# Altium schematic sheet DCTODC_Multioutput.SchDoc
size A4; Date: Not shown in title block; ApprovedBy: Not shown in title block; CheckedBy: Not shown in title block; Author: Not shown in title block; CompanyName: Not shown in title block; Engineer: Not shown in title block; Organization: Not shown in title block; Address1: Not shown in title block; Address2: Not shown in title block; Address3: Not shown in title block; Address4: Not shown in title block; DocumentNumber: 1; Revision: Use project parameter SCH_Rev; SheetNumber: 1; SheetTotal: 1; PageSetup: Record=PageOptions|CenterHorizontal=True|CenterVertical=True|PrintScale=1.00|XCorrection=1.00|YCorrection=1.00|PrintKind=0|BorderSize=5000000|LeftOffset=0|BottomOffset=0|Orientation=2|PaperLength=1000|PaperWidth=1000|Scale=100|PaperSource=15|PrintQuality=600|MediaType=1|DitherType=10|PaperKind=Letter|PrintScaleMode=1; CurrentTime: Not shown in title block; CurrentDate: Not shown in title block; Time: Not shown in title block; DocumentFullPathAndName: Not shown in title block; DocumentName: Not shown in title block; ModifiedDate: Not shown in title block; ImagePath: Not shown in title block
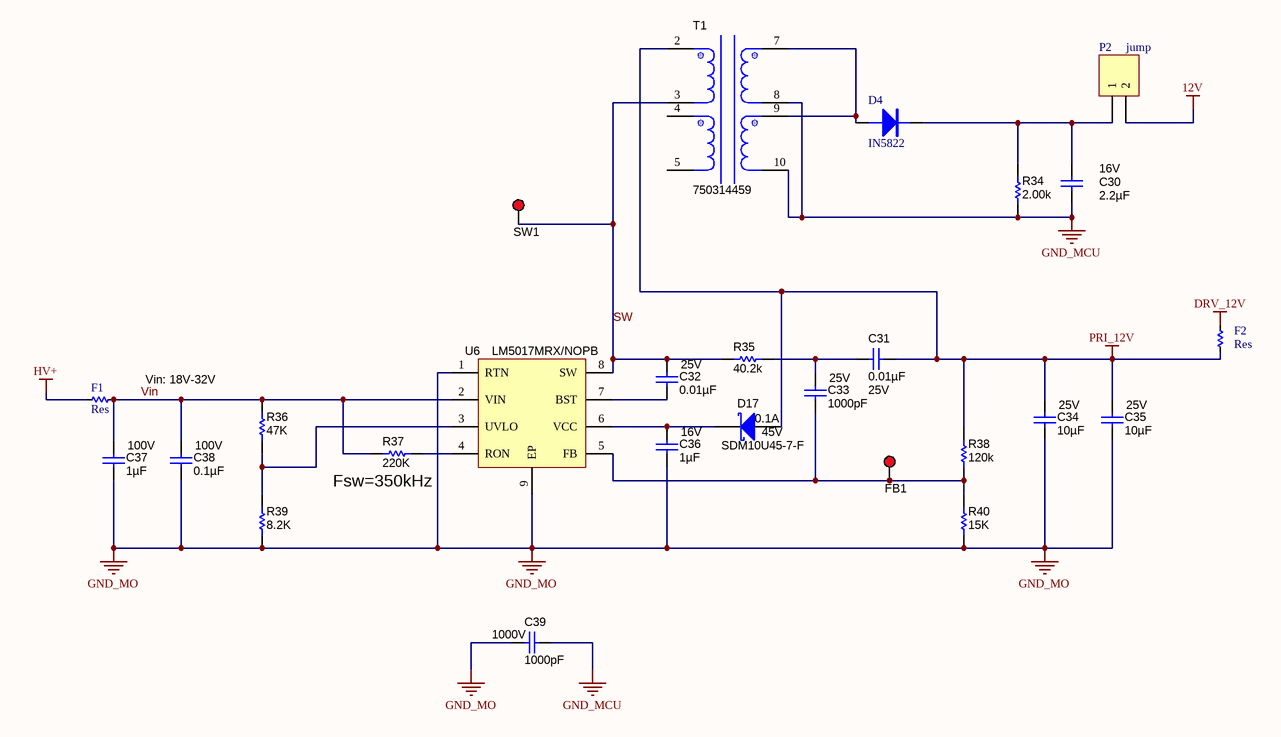
[diagram p0: DCTODC_Multioutput.SchDoc]

## Parts
C30  ValueDisplayed: 2.2µF  Value2: 16V  [0805_HV]  (hidden comment: C0805C225K4RACTU)
C31  ValueDisplayed: 0.01µF  Value2: 25V  [0805_hv]  (hidden comment: C1608C0G1E103J)
C32  ValueDisplayed: 0.01µF  Value2: 25V  [0805_HV]  (hidden comment: C1608C0G1E103J)
C33  ValueDisplayed: 1000pF  Value2: 25V  [0805_hv]  (hidden comment: GRM1885C1E102JA01D)
C34  ValueDisplayed: 10µF  Value2: 25V  [1210]  (hidden comment: C3225X7R1E106M)
C35  ValueDisplayed: 10µF  Value2: 25V  [1210]  (hidden comment: C3225X7R1E106M)
C36  ValueDisplayed: 1µF  Value2: 16V  [0805_HV]  (hidden comment: C1608X5R1C105K)
C37  ValueDisplayed: 1µF  Value2: 100V  [1210]  (hidden comment: C3225X7R2A105K200AA)
C38  ValueDisplayed: 0.1µF  Value2: 100V  [0805_HV]  (hidden comment: C2012X7R2A104K)
C39  ValueDisplayed: 1000pF  Value2: 1000V  [1210]  (hidden comment: VJ1210A102JXGAT5Z)
D4  IN5822  [SOD123]
D17  SDM10U45-7-F  Value1: 0.1A  Vr_V: 45V  [SOD-123]
F1  Res  [1206]
F2  Res  [1206]
FB1  5000  [Keystone5000]  (value not drawn)
P2  jump  [HDR1X2]
R34  ValueDisplayed: 2.00k  [0805_hv]  (hidden comment: CRCW06032K00FKEA)
R35  ValueDisplayed: 40.2k  [0805_HV]  (hidden comment: RC0603FR-0740K2L)
R36  ValueDisplayed: 47K  [0805_HV]  (hidden comment: CRCW0603100KFKEA)
R37  ValueDisplayed: 220K  [0805_HV]  (hidden comment: 1879339-3)
R38  ValueDisplayed: 120k  [0805_hv]  (hidden comment: RT0603DRE07140KL)
R39  ValueDisplayed: 8.2K  [0805_HV]  (hidden comment: CRCW06038K87FKEA)
R40  ValueDisplayed: 15K  [0805_hv]  (hidden comment: CRCW060320K0FKEA)
SW1  5000  [Keystone5000]  (value not drawn)
T1  750314459  [POE13P]
U6  LM5017MRX/NOPB  [MRA08A_N]

## Nets
12V: P2.2
DRV_12V: F2.2
GND_MCU: C30.2 C39.1 R34.1 T1.8 T1.10
GND_MO: C34.2 C35.2 C36.2 C37.2 C38.2 C39.2 R39.1 R40.1 U6.1(RTN) U6.9(EP)
HV+: F1.2
PRI_12V: C31.2 C34.1 C35.1 D17.2(A) F2.1 R38.2 T1.2
SW: C32.1 R35.1 SW1.1 T1.3 U6.8(SW)
Vin: C37.1 C38.1 F1.1 R36.2 R37.1 U6.2(VIN)
NetC30_1: C30.1 D4.2 P2.1 R34.2
NetC31_1: C31.1 C33.1 R35.2
NetC32_2: C32.2 U6.7(BST)
NetC33_2: C33.2 FB1.1 R38.1 R40.2 U6.5(FB)
NetC36_1: C36.1 D17.1(K) U6.6(VCC)
NetD4_1: D4.1 T1.7 T1.9
NetR36_1: R36.1 R39.2 U6.3(UVLO)
NetR37_2: R37.2 U6.4(RON)

Not connected (* = marked no-connect by the designer): T1 4 5

## Notes on the sheet
- Vin: 18V-32V
- (near R37) Fsw=350kHz

## Library data of the parts
C30 = C0805C225K4RACTU: CAP, CERM, 2.2 µF, 16 V, +/- 10%, X7R, 0805; Manufacturer: Kemet; Polarized: N; CompType: Capacitor; Value: 2.2uF; U/M: EA; Cap_F: 0.0000022; Tolerance_%: 10; ESR_ohm: 0.008; Value1: 0.008 ohm; VDC_V: 16; IRMS_A: 15.55; TaMin_C: -55; TaMax_C: 125; Cap_Case: 0805; SymbolVersion: 2008-07-09; PartNumber: C0805C225K4RACTU; PackageReference: 0805; RoHS: Y; MountType: SMT; Technology: Ceramic; TempCo: X7R; Published: 2008-06-19; Publisher: Texas Instruments; LatestRevisionDate: 2014-09-12; ComponentLink1Description: Datasheet link; ComponentLink1URL: http://www.kemet.com/kemet/web/homepage/kechome.nsf/file/Partial%20Copy%20-%20Ceramic%20Surface%20Mount%20Capacitors/$file/F3102_CE.pdf; Supplier 1: Digi-Key; Supplier Part Number 1: 399-3523-1-ND; Supplier 2: Mouser; Supplier Part Number 2: 80-C0805C225K4R; Supplier 3: Farnell; Supplier Part Number 3: 1288262
C31 C32 = C1608C0G1E103J: CAP, CERM, 0.01 µF, 25 V, +/- 5%, C0G/NP0, 0603; Manufacturer: TDK; Polarized: N; CompType: Capacitor; Value: 0.01uF; U/M: EA; Cap_F: 0.00000001; Tolerance_%: 5; Value1: Unknown; VDC_V: 25; TaMin_C: -55; TaMax_C: 125; Cap_Case: 0603; SymbolVersion: 2008-07-09; PartNumber: C1608C0G1E103J; PackageReference: 0603; RoHS: Y; MountType: SMT; Technology: Ceramic; TempCo: C0G/NP0; Published: 2008-06-19; Publisher: Texas Instruments; LatestRevisionDate: 2014-09-12; ComponentLink1Description: Datasheet link; ComponentLink1URL: http://www.tdk.co.jp/tefe02/e412_c.pdf; Supplier 1: Digi-Key; Supplier Part Number 1: 445-2664-1-ND; Supplier 2: Farnell; Supplier Part Number 2: 1844146
C33 = GRM1885C1E102JA01D: CAP, CERM, 1000 pF, 25 V, +/- 5%, C0G/NP0, 0603; Manufacturer: MuRata; Polarized: N; CompType: Capacitor; Value: 1000pF; U/M: EA; Cap_F: 0.000000001; Tolerance_%: 5; Value1: Unknown; VDC_V: 25; TaMin_C: -55; TaMax_C: 125; Cap_Case: 0603; SymbolVersion: 2008-07-09; PartNumber: GRM1885C1E102JA01D; PackageReference: 0603; RoHS: Y; MountType: SMT; Technology: Ceramic; TempCo: C0G/NP0; Published: 2008-06-19; Publisher: Texas Instruments; LatestRevisionDate: 2014-09-12; ComponentLink1Description: Datasheet link; ComponentLink1URL: http://search.murata.co.jp/Ceramy/PnsearchViewAction.do?HnOFG=ON&HnNFG=ON&SEL_CNT=50&sLang=en&sKey=GRM1885C1E102JA01D&x=9&y=9&search=startwith; Supplier 1: Digi-Key; Supplier Part Number 1: GRM1885C1E102JA01D-ND; Supplier 2: Mouser; Supplier Part Number 2: 81-GRM39C102J25
C34 C35 = C3225X7R1E106M: CAP, CERM, 10 µF, 25 V, +/- 20%, X7R, 1210; Manufacturer: TDK; Polarized: N; CompType: Capacitor; Value: 10uF; U/M: EA; Cap_F: 0.00001; Tolerance_%: 20; ESR_ohm: 0.0027; Value1: 0.0027 ohm; VDC_V: 25; IRMS_A: 3; TaMin_C: -55; TaMax_C: 125; SymbolVersion: 2008-07-09; PartNumber: C3225X7R1E106M; PackageReference: 1210; RoHS: Y; MountType: SMT; Technology: Ceramic; TempCo: X7R; Cap_Case: 1210; Published: 2008-06-19; Publisher: Texas Instruments; LatestRevisionDate: 2014-09-12; ComponentLink1Description: Datasheet link; ComponentLink1URL: http://www.tdk.co.jp/tefe02/e412_c.pdf; Supplier 1: Digi-Key; Supplier Part Number 1: 445-1434-1-ND; Supplier 2: Farnell; Supplier Part Number 2: 1844358
C36 = C1608X5R1C105K: CAP, CERM, 1 µF, 16 V, +/- 10%, X5R, 0603; Manufacturer: TDK; Polarized: N; CompType: Capacitor; Value: 1uF; U/M: EA; Cap_F: 0.000001; Tolerance_%: 10; ESR_ohm: 0.0057; Value1: 0.0057 ohm; VDC_V: 16; TaMin_C: -55; TaMax_C: 85; Cap_Case: 0603; SymbolVersion: 2008-07-09; PartNumber: C1608X5R1C105K; PackageReference: 0603; RoHS: Y; MountType: SMT; Technology: Ceramic; TempCo: X5R; Published: 2008-06-19; Publisher: Texas Instruments; LatestRevisionDate: 2014-09-12; ComponentLink1Description: Datasheet link; ComponentLink1URL: http://www.tdk.co.jp/tefe02/e412_c.pdf; Supplier 1: Digi-Key; Supplier Part Number 1: 445-1416-1-ND; Supplier 2: Farnell; Supplier Part Number 2: 1844208
C37 = C3225X7R2A105K200AA: CAP, CERM, 1 µF, 100 V, +/- 10%, X7R, 1210; Manufacturer: TDK; Polarized: N; CompType: Capacitor; Value: 1uF; U/M: EA; Cap_F: 0.000001; Tolerance_%: 10; Value1: Unknown; VDC_V: 100; TaMin_C: -55; TaMax_C: 125; SymbolVersion: 2008-07-09; PartNumber: C3225X7R2A105K200AA; PackageReference: 1210; RoHS: Y; MountType: SMT; Technology: Ceramic; TempCo: X7R; Cap_Case: 1210; Published: 2008-06-19; Publisher: Texas Instruments; LatestRevisionDate: 2014-09-12; ComponentLink1Description: Datasheet link; ComponentLink1URL: http://www.tdk.com/pdf/mlcc_prod_guide/MLCC%20Product%20Guide%20A14.pdf; Supplier 1: Digi-Key; Supplier Part Number 1: 445-2294-1-ND; Supplier 2: Mouser; Supplier Part Number 2: 810-C3225X7R2A105K; Supplier 3: Farnell; Supplier Part Number 3: 2372082
C38 = C2012X7R2A104K: CAP, CERM, 0.1 µF, 100 V, +/- 10%, X7R, 0805; Manufacturer: TDK; Polarized: N; CompType: Capacitor; Value: 0.1uF; U/M: EA; Cap_F: 0.0000001; Tolerance_%: 10; ESR_ohm: 0.0158; Value1: 0.0158 ohm; VDC_V: 100; TaMin_C: -55; TaMax_C: 125; Cap_Case: 0805; SymbolVersion: 2008-07-09; PartNumber: C2012X7R2A104K; PackageReference: 0805; RoHS: Y; MountType: SMT; Technology: Ceramic; TempCo: X7R; Published: 2008-06-19; Publisher: Texas Instruments; LatestRevisionDate: 2014-09-12; ComponentLink1Description: Datasheet link; ComponentLink1URL: http://www.tdk.co.jp/tefe02/e412_c.pdf; Supplier 1: Digi-Key; Supplier Part Number 1: 445-1418-1-ND; Supplier 2: Farnell; Supplier Part Number 2: 1844410
C39 = VJ1210A102JXGAT5Z: CAP, CERM, 1000 pF, 1000 V, +/- 5%, C0G/NP0, 1210; Manufacturer: Vishay-Vitramon; Polarized: N; CompType: Capacitor; Value: 1000pF; U/M: EA; Cap_F: 0.000000001; Tolerance_%: 5; Value1: Unknown; VDC_V: 1000; TaMin_C: -55; TaMax_C: 125; SymbolVersion: 2008-07-09; PartNumber: VJ1210A102JXGAT5Z; PackageReference: 1210; RoHS: Y; MountType: SMT; Technology: Ceramic; TempCo: C0G/NP0; Cap_Case: 1210; Published: 2008-06-19; Publisher: Texas Instruments; LatestRevisionDate: 2014-09-12; ComponentLink1Description: Datasheet link; ComponentLink1URL: http://www.vishay.com/docs/45199/commseri.pdf; Supplier 1: Digi-Key; Supplier Part Number 1: 720-1036-1-ND; Supplier 2: Mouser; Supplier Part Number 2: 77-VJ1210A102JXGAT5Z
D4 = Diode S4 SOD123 ( 1N5819 SOD123)_MH: Diode S4 SOD123 ( 1N5819 SOD123)
D17 = SDM10U45-7-F: Diode, Schottky, 45 V, 0.1 A, SOD-523; Manufacturer: Diodes Inc.; U/M: EA; Vf_V: 0.58; Value: 45V; Value2: 0.58V; Io_A: 0.1; TJmax_C: 125; CompType: Diode; SymbolVersion: 2008-12-08; PartNumber: SDM10U45-7-F; PackageReference: SOD-523; MountType: SMT; Type: Schottky; RoHS: Y; Published: 2008-06-26; Publisher: Texas Instruments; LatestRevisionDate: 2014-09-08; ComponentLink1Description: Datasheet link; ComponentLink1URL: http://www.diodes.com/datasheets/ds30394.pdf; Supplier 1: Digi-Key; Supplier Part Number 1: SDM10U45-FDICT-ND; Supplier 2: Mouser; Supplier Part Number 2: 621-SDM10U45-F
F1 F2 = Res-SMD: Resistor; Manufacturer: Generic Components; Class: Passive; Published: 08/06/2000; Publisher: Altium Hobart Technology Centre
FB1 SW1 = 5000: Test Point, Miniature, Red, TH; Manufacturer: Keystone; CompType: Test Point Loop; U/M: EA; SymbolVersion: 2008-04-04; PartNumber: 5000; Value: Red; PackageReference: Red Miniature Testpoint; RoHS: Y; MountType: TH; ComponentLink1Description: Datasheet Link; ComponentLink1URL: http://www.keyelco.com/userAssets/file/M60-2p60.pdf; Publisher: Texas Instruments; LatestRevisionDate: 2014-09-12; Supplier 1: Digi-Key; Supplier Part Number 1: 5000K-ND
P2 = Header 2: Header, 2-Pin; LatestRevisionDate: 17-Jul-2002; LatestRevisionNote: Re-released for DXP Platform.; Publisher: Altium Limited
R34 = CRCW06032K00FKEA: RES, 2.00 k, 1%, 0.1 W, 0603; Manufacturer: Vishay-Dale; CompType: Resistor; Value: 2.00k; Res_ohm: 2000; Value_Code: 2k00; Tolerance_%: 1; Power_W: 0.1; Value2: 0.1W; VDC_V: 75; TempCo: 100 ppm/C; EIA_Code: E96; U/M: EA; SymbolVersion: 2009-05-29; PartNumber: CRCW06032K00FKEA; PackageReference: 0603; RoHS: Y; Value1: 1%; MountType: SMT; Technology: Thick Film; Published: 2008-06-26; Publisher: Texas Instruments; LatestRevisionDate: 2014-09-10; ComponentLink1Description: Datasheet link; ComponentLink1URL: http://www.vishay.com/docs/20035/dcrcwe3.pdf; Supplier 1: Digi-Key; Supplier Part Number 1: 541-2.00KHCT-ND; Supplier 2: Mouser; Supplier Part Number 2: 71-CRCW0603-2.0K-E3; Supplier 3: Farnell; Supplier Part Number 3: 1469764
R35 = RC0603FR-0740K2L: RES, 40.2 k, 1%, 0.1 W, 0603; Manufacturer: Yageo America; CompType: Resistor; Value: 40.2k; Res_ohm: 40200; Value_Code: 40k2; Tolerance_%: 1; Power_W: 0.1; Value2: 0.1W; VDC_V: 150; TempCo: 200 ppm/C; EIA_Code: E96; U/M: EA; SymbolVersion: 2009-05-29; PartNumber: RC0603FR-0740K2L; PackageReference: 0603; RoHS: Y; Value1: 1%; MountType: SMT; Technology: Thick Film; Published: 2008-06-26; Publisher: Texas Instruments; LatestRevisionDate: 2014-09-10; ComponentLink1Description: Datasheet link; ComponentLink1URL: http://www.yageo.com/pdf/Pu-RC0603_51_PbFree_L_2.pdf; Supplier 1: Digi-Key; Supplier Part Number 1: 311-40.2KHRCT-ND; Supplier 2: Mouser; Supplier Part Number 2: 603-RC0603FR-0740K2L
R36 = CRCW0603100KFKEA: RES, 100 k, 1%, 0.1 W, 0603; Manufacturer: Vishay-Dale; CompType: Resistor; Value: 100k; Res_ohm: 100000; Tolerance_%: 1; Power_W: 0.1; Value2: 0.1W; VDC_V: 75; TempCo: 100 ppm/C; EIA_Code: E96; U/M: EA; SymbolVersion: 2009-05-29; PartNumber: CRCW0603100KFKEA; PackageReference: 0603; RoHS: Y; Value_Code: 100k; Value1: 1%; MountType: SMT; Technology: Thick Film; Published: 2008-06-26; Publisher: Texas Instruments; LatestRevisionDate: 2014-09-10; ComponentLink1Description: Datasheet link; ComponentLink1URL: http://www.vishay.com/docs/20035/dcrcwe3.pdf; Supplier 1: Digi-Key; Supplier Part Number 1: 541-100KHCT-ND; Supplier 2: Mouser; Supplier Part Number 2: 71-CRCW0603-100K-E3; Supplier 3: Farnell; Supplier Part Number 3: 1469649
R37 = 1879339-3: RES, 301 k, 1%, 0.063 W, 0603; Manufacturer: TE Connectivity; CompType: Resistor; Value: 301k; Res_ohm: 301000; Tolerance_%: 1; Power_W: 0.063; Value2: 0.063W; VDC_V: 50; TempCo: 50 ppm/C; EIA_Code: E96; U/M: EA; SymbolVersion: 2009-05-29; PartNumber: 1879339-3; PackageReference: 0603; RoHS: Y; Value_Code: 301k; Value1: 1%; MountType: SMT; Technology: Thin Film; Published: 2008-06-26; Publisher: Texas Instruments; LatestRevisionDate: 2014-09-10; ComponentLink1Description: Datasheet link; ComponentLink1URL: http://www.te.com/commerce/DocumentDelivery/DDEController?Action=showdoc&DocId=Data+Sheet%7F1773200%7FH%7Fpdf%7FEnglish%7FENG_DS_1773200_H.pdf; Supplier 1: Digi-Key; Supplier Part Number 1: A102259CT-ND
R38 = RT0603DRE07140KL: RES, 140 k, 0.5%, 0.1 W, 0603; Manufacturer: Yageo America; CompType: Resistor; Value: 140k; Res_ohm: 140000; Tolerance_%: 0.5; Power_W: 0.1; Value2: 0.1W; VDC_V: 75; TempCo: 50 ppm/C; EIA_Code: E192; U/M: EA; SymbolVersion: 2009-05-29; PartNumber: RT0603DRE07140KL; PackageReference: 0603; RoHS: Y; Value_Code: 140k; Value1: 0.5%; MountType: SMT; Technology: Thin Film; Published: 2008-06-26; Publisher: Texas Instruments; LatestRevisionDate: 2014-09-19; ComponentLink1Description: Datasheet link; ComponentLink1URL: http://www.yageo.com/pdf/PYu-RT_1-to-0.05_RoHS_L_3.pdf
R39 = CRCW06038K87FKEA: RES, 8.87 k, 1%, 0.1 W, 0603; Manufacturer: Vishay-Dale; CompType: Resistor; Value: 8.87k; Res_ohm: 8870; Value_Code: 8k87; Tolerance_%: 1; Power_W: 0.1; Value2: 0.1W; VDC_V: 75; TempCo: 100 ppm/C; EIA_Code: E96; U/M: EA; SymbolVersion: 2009-05-29; PartNumber: CRCW06038K87FKEA; PackageReference: 0603; RoHS: Y; Value1: 1%; MountType: SMT; Technology: Thick Film; Published: 2008-06-26; Publisher: Texas Instruments; LatestRevisionDate: 2014-09-10; ComponentLink1Description: Datasheet link; ComponentLink1URL: http://www.vishay.com/docs/20035/dcrcwe3.pdf; Supplier 1: Digi-Key; Supplier Part Number 1: 541-8.87KHCT-ND; Supplier 2: Mouser; Supplier Part Number 2: 71-CRCW0603-8.87K-E3; Supplier 3: Farnell; Supplier Part Number 3: 1574020
R40 = CRCW060320K0FKEA: RES, 20.0 k, 1%, 0.1 W, 0603; Manufacturer: Vishay-Dale; CompType: Resistor; Value: 20.0k; Res_ohm: 20000; Value_Code: 20k0; Tolerance_%: 1; Power_W: 0.1; Value2: 0.1W; VDC_V: 75; TempCo: 100 ppm/C; EIA_Code: E96; U/M: EA; SymbolVersion: 2009-05-29; PartNumber: CRCW060320K0FKEA; PackageReference: 0603; RoHS: Y; Value1: 1%; MountType: SMT; Technology: Thick Film; Published: 2008-06-26; Publisher: Texas Instruments; LatestRevisionDate: 2014-09-10; ComponentLink1Description: Datasheet link; ComponentLink1URL: http://www.vishay.com/docs/20035/dcrcwe3.pdf; Supplier 1: Digi-Key; Supplier Part Number 1: 541-20.0KHCT-ND; Supplier 2: Mouser; Supplier Part Number 2: 71-CRCW0603-20K-E3; Supplier 3: Farnell; Supplier Part Number 3: 1469774
T1 = POE13: XFMR, SMT 45uH, 750314459; Manufacturer: Wurth; PCB DECAL: Used in BOM report.  Use Y or N.; Area: 164.465 sq.mm; Value: 45uH; ModifyDate: 9/23/2014; PartNumber: 750314459; Size: 12.7mmX12.95mmX5.98mm(h)
U6 = LM5017MRX/NOPB: 100V Constant On-Time PFET Buck Switching Controller, 8-pin PSOP, Pb-Free; Manufacturer: National Semiconductor; PowerWise: Y; CompType: Switcher; Published: 1-Mar-2010; DatasheetVersion: Dec-2009; PackageVersion: revD, Dec-2007; PackageReference: MRA08A; Publisher: Altium Limited; PackageDescription: Molded, PSOP .193 x .154 x .058in, 8 Lead, .050in Pitch; Supplier 1: Digi-Key; Supplier Part Number 1: LM5017MRX-ND; PartNumber: LM5017MRX/NOPB; RoHS: Y; PinCount: 8; Code_JEDEC: MS-012-AA; ComponentLink1Description: LM5017 Datasheet; ComponentLink1URL: http://www.national.com/ds/LM/LM5017.pdf; ComponentLink2Description: LM5017 Web Page; ComponentLink2URL: http://www.national.com/pf/LM/LM5017.html; ComponentLink3Description: MRA08A Package Page; ComponentLink3URL: http://www.national.com/packaging/folders/mra08a.html